# Altium schematic sheet 09-TESTPOINTS.SchDoc: Testpoints and fiducials
size A3; DrawnBy: Rain Adelbert; Revision: 1.2; SheetNumber: 9; SheetTotal: 9
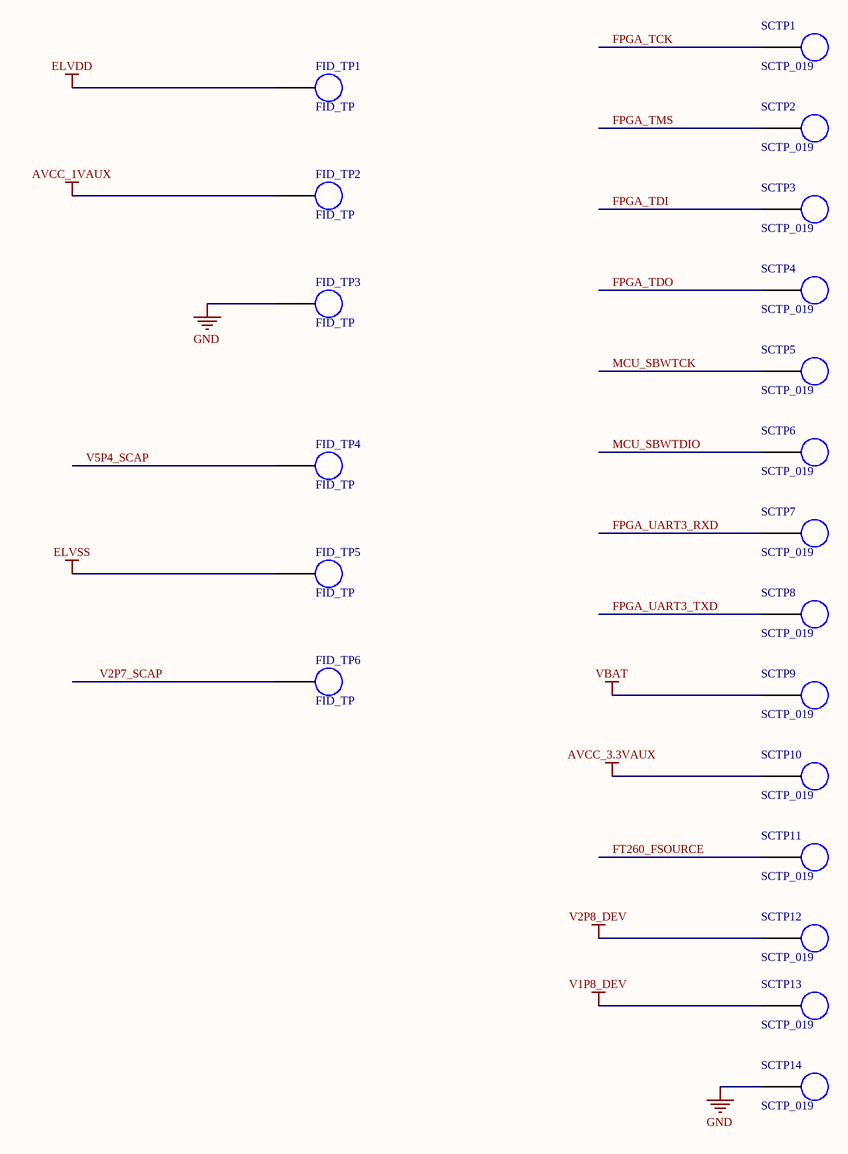
[diagram p0: 09-TESTPOINTS.SchDoc]

## Parts
FID_TP1  FID_TP  [FID_TP]
FID_TP2  FID_TP  [FID_TP]
FID_TP3  FID_TP  [FID_TP]
FID_TP4  FID_TP  [FID_TP]
FID_TP5  FID_TP  [FID_TP]
FID_TP6  FID_TP  [FID_TP]
SCTP1  SCTP_019  [SCTP_019]
SCTP2  SCTP_019  [SCTP_019]
SCTP3  SCTP_019  [SCTP_019]
SCTP4  SCTP_019  [SCTP_019]
SCTP5  SCTP_019  [SCTP_019]
SCTP6  SCTP_019  [SCTP_019]
SCTP7  SCTP_019  [SCTP_019]
SCTP8  SCTP_019  [SCTP_019]
SCTP9  SCTP_019  [SCTP_019]
SCTP10  SCTP_019  [SCTP_019]
SCTP11  SCTP_019  [SCTP_019]
SCTP12  SCTP_019  [SCTP_019]
SCTP13  SCTP_019  [SCTP_019]
SCTP14  SCTP_019  [SCTP_019]

## Nets
AVCC_1VAUX: FID_TP2.TP
AVCC_3.3VAUX: SCTP10.SCTP
ELVDD: FID_TP1.TP
ELVSS: FID_TP5.TP
GND: FID_TP3.TP SCTP14.SCTP
V1P8_DEV: SCTP13.SCTP
V2P8_DEV: SCTP12.SCTP
VBAT: SCTP9.SCTP
FPGA_TCK: SCTP1.SCTP
FPGA_TDI: SCTP3.SCTP
FPGA_TDO: SCTP4.SCTP
FPGA_TMS: SCTP2.SCTP
FPGA_UART3_RXD: SCTP7.SCTP
FPGA_UART3_TXD: SCTP8.SCTP
FT260_FSOURCE: SCTP11.SCTP
MCU_SBWTCK: SCTP5.SCTP
MCU_SBWTDIO: SCTP6.SCTP
V2P7_SCAP: FID_TP6.TP
V5P4_SCAP: FID_TP4.TP

## Notes on the sheet
- Title
- Size:
- Date:
- A3
- https://asicvault.io
- Time:
- Revision:
- Sheet
- of
- 2.0.6
- Copyright © 2016-2021 AsicVault Ltd.
- Tornimäe 5, 2nd floor, Tallinn 10145, Estonia
- Authors: Hando Eilsen, Rain Adelbert, Robbie B.H.
- License: Apache 2.0 with Commons Clause
- Please read LICENSE.md
- File:

## Library data of the parts
FID_TP1-FID_TP6 = FID_TP: Fiducial Testpoint
SCTP1-SCTP14 = SCTP_019: 0.019" Spring Contact Testpoint